# EAGLE design LegoConnectorX1 (EAGLE 9.0.0)
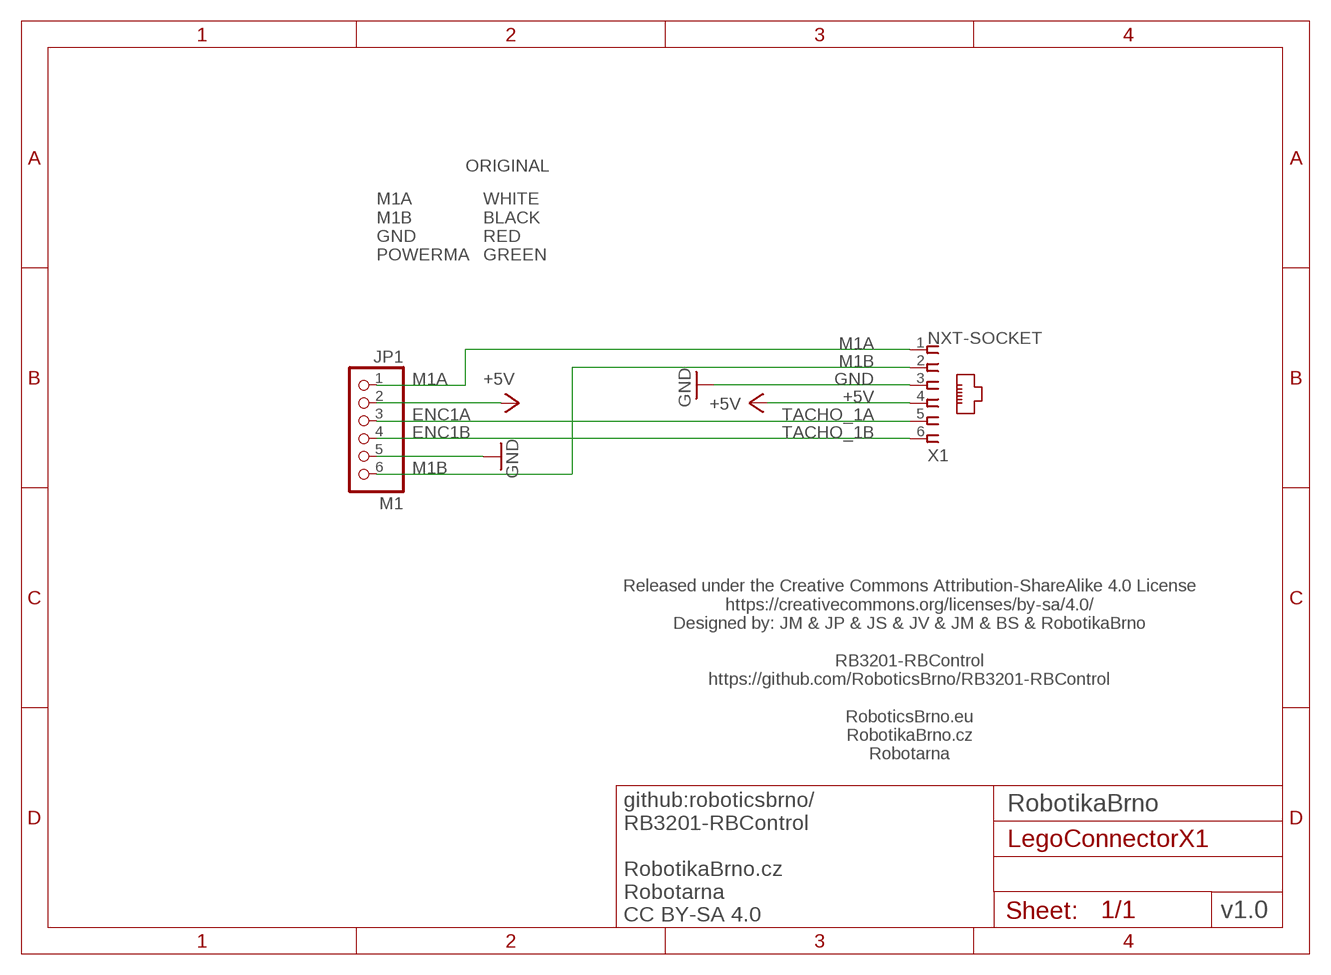
[diagram p0: schematic, sheet 1]

## Parts
JP1  M1  PINHD-1X6  [1X06]
X1  NXT-SOCKET  [NXT-SOCKET]

## Nets
+5V: JP1.2 X1.4
GND: JP1.5 X1.3
M1A: JP1.1 X1.1
M1B: JP1.6 X1.2
TACHO_1A: JP1.3 X1.5
TACHO_1B: JP1.4 X1.6

## Notes on the sheet
- ORIGINAL
- M1A
  M1B
  GND
  POWERMA
- WHITE
  BLACK
  RED
  GREEN
- ENC1A
- ENC1B
- Released under the Creative Commons Attribution-ShareAlike 4.0 License
  https://creativecommons.org/licenses/by-sa/4.0/
  Designed by: JM & JP & JS & JV & JM & BS & RobotikaBrno
  
  RB3201-RBControl
  https://github.com/RoboticsBrno/RB3201-RBControl
  
  RoboticsBrno.eu
  RobotikaBrno.cz
  Robotarna
- RobotikaBrno
- v1.0
- github:roboticsbrno/
  RB3201-RBControl
  
  RobotikaBrno.cz
  Robotarna
  CC BY-SA 4.0

## Library data of the parts
JP1 = pinhead:PINHD-1X6: PIN HEADER
X1 = NXT Compatible (female) Sockets - Mindsensors:NXT-SOCKET: RJ11 6 connects Manufacturer: Mindsensors.com Source: NXT-Female-Socket.pdf; OC_FARNELL: unknown; OC_NEWARK: unknown

## Net classes
0 default: width 0.2 mm, drill 0.35 mm, clearance 0.2 mm

## Board
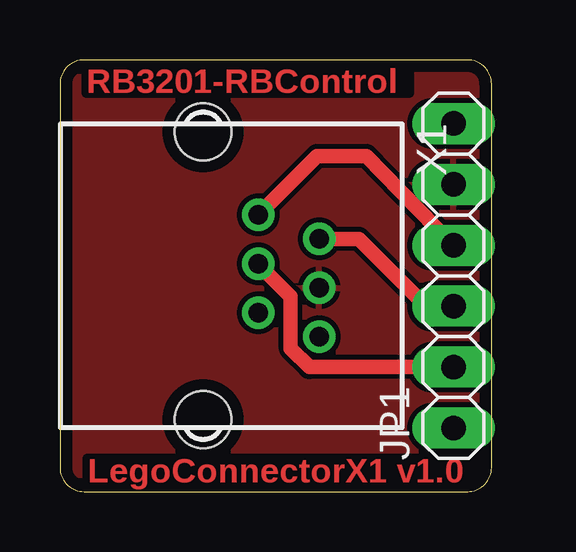
[diagram p1: board, top side]
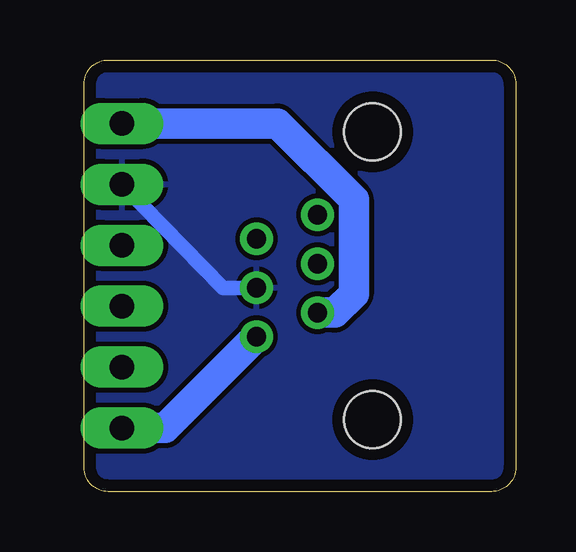
[diagram p2: board, bottom side, seen from below]

Size 18 x 18 mm. Coordinates in mm from the lower left corner, seen from the top.
Outline: 0,17 0,1 arc90 1,0 17,0 arc90 18,1 18,17 arc90 17,18 1,18 arc90 0,17
Copper layers (1*16): Top 0.035mm / dielectric 1.5mm / Bottom 0.035mm
Design rules "robotikabrno": minimum track width 0.2mm, minimum drill 0.35mm, track to track 0.2mm, track to pad 0.2mm, pad to pad 0.2mm, via to via 0.2mm, smd to smd 0.2mm, copper to edge 0.5mm, drill to drill 0.5mm, minimum pad ring 0.16mm, minimum via ring 0.16mm, stop-mask expansion 0.1mm, vias tented up to drill 0.4mm, thermal gap 0.2mm

### Footprints (pad centres in the part's own frame; a part is rotated, then mirrored left to right if it is on the bottom)
1X06 = drill 1.016 long: 1 -6.35,0; 2 -3.81,0; 3 -1.27,0; 4 1.27,0; 5 3.81,0; 6 6.35,0
NXT-SOCKET = drill 0.8 pad 1.3: 1 2.54,10.809; 2 1.54,8.269; 3 0.5,10.809; 4 -0.5,8.269; 5 -1.54,10.809; 6 -2.54,8.269 | hole 2.36: -6,5.969; 6,5.969

### Placement (x,y rotation side)
JP1  16.41,9 90 top
X1  0,9 270 top

### Tracks (layer width: path | path; a pad name or v marks a point on that pad's centre or on a via)
+5V
  Top 0.61: JP1.2 10.4,5.19 9.62,5.97 9.62,8.14 X1.4
GND
  Bottom 0.61: JP1.5 12.2,8.5 X1.3
  pour Top: 0,0 18.4,0 18.4,18.48 0,18.48
  pour Bottom: 0,0 18.4,0 18.4,18.48 0,18.48
M1A
  Bottom 1.27: JP1.1 14.62,2.65 X1.1
M1B
  Bottom 1.27: JP1.6 9.94,15.35 6.75,12.17 6.75,8.25 7.54,7.46 X1.2
TACHO_1A
  Top 0.61: JP1.3 15.27,7.73 12.46,10.54 X1.5
TACHO_1B
  Top 0.61: JP1.4 12.78,14 10.73,14 X1.6

### Text on the board
Top: RB3201-RBControl | LegoConnectorX1 v1.0
tDocu: LED1 / RED | R1 / 1k | RB3201-RBControl | MB | - | EB | EA | + | MA | LegoConnectorX1 v1.0